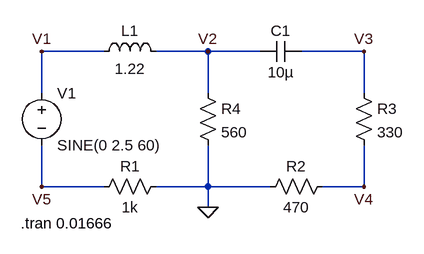
[diagram p0: schematic mallas.asc]
mallas.asc, the LTspice schematic file:
Version 4
SHEET 1 880 680
WIRE 16 64 -80 64
WIRE 176 64 96 64
WIRE 256 64 176 64
WIRE 416 64 320 64
WIRE -80 128 -80 64
WIRE 176 128 176 64
WIRE 416 128 416 64
WIRE -80 272 -80 208
WIRE 16 272 -80 272
WIRE 176 272 176 208
WIRE 176 272 96 272
WIRE 272 272 176 272
WIRE 416 272 416 208
WIRE 416 272 352 272
WIRE 176 304 176 272
FLAG 176 304 0
FLAG 176 64 V2
FLAG -80 64 V1
FLAG 416 64 V3
FLAG 416 272 V4
FLAG -80 272 V5
SYMBOL voltage -80 112 R0
WINDOW 123 0 0 Left 2
WINDOW 39 0 0 Left 2
SYMATTR InstName V1
SYMATTR Value SINE(0 2.5 60)
SYMBOL res 112 256 R90
WINDOW 0 0 56 VBottom 2
WINDOW 3 32 56 VTop 2
SYMATTR InstName R1
SYMATTR Value 1k
SYMBOL res 368 256 R90
WINDOW 0 0 56 VBottom 2
WINDOW 3 32 56 VTop 2
SYMATTR InstName R2
SYMATTR Value 470
SYMBOL ind 0 80 R270
WINDOW 0 32 56 VTop 2
WINDOW 3 5 56 VBottom 2
SYMATTR InstName L1
SYMATTR Value 1.22
SYMBOL cap 320 48 R90
WINDOW 0 0 32 VBottom 2
WINDOW 3 32 32 VTop 2
SYMATTR InstName C1
SYMATTR Value 10µ
SYMBOL res 160 112 R0
SYMATTR InstName R4
SYMATTR Value 560
SYMBOL res 400 112 R0
SYMATTR InstName R3
SYMATTR Value 330
TEXT -112 328 Left 2 !.tran 0.01666

The netlist it stands for:
* mallas.asc
V1 V1 V5 SINE(0 2.5 60)
R1 0 V5 1k
R2 V4 0 470
L1 V1 V2 1.22
C1 V3 V2 10µ
R4 V2 0 560
R3 V3 V4 330
.tran 0.01666
.backanno
.end